# Altium schematic sheet DRIVERS.SchDoc
size A; Organization: Altium Limited; Address1: L3, 12a Rodborough Rd; Address2: Frenchs Forest; Address3: NSW; Address4: Australia 2086; DocumentNumber: 3; SheetNumber: 3; SheetTotal: 4
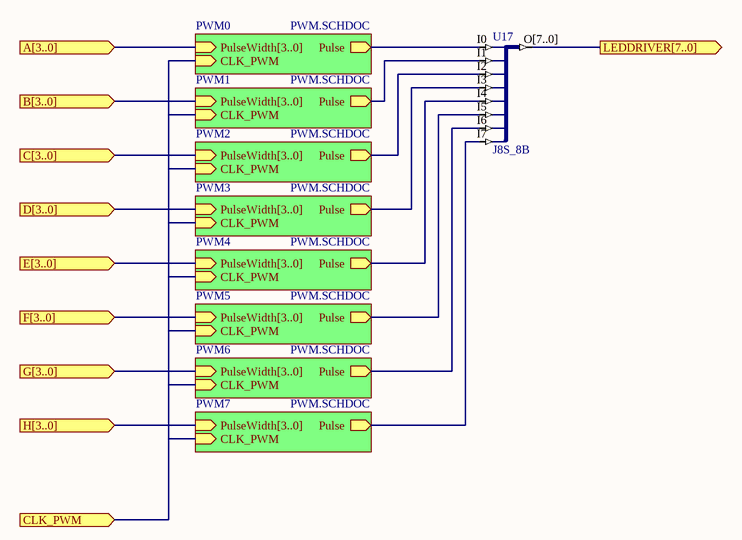
[diagram p0: DRIVERS.SchDoc]

## Parts
U17  J8S_8B

## Sub-sheets
PWM0 = PWM.SCHDOC: Pulse (out), CLK_PWM (in), PulseWidth[3..0] (in)
PWM1 = PWM.SCHDOC: Pulse (out), CLK_PWM (in), PulseWidth[3..0] (in)
PWM2 = PWM.SCHDOC: Pulse (out), CLK_PWM (in), PulseWidth[3..0] (in)
PWM3 = PWM.SCHDOC: Pulse (out), CLK_PWM (in), PulseWidth[3..0] (in)
PWM4 = PWM.SCHDOC: Pulse (out), CLK_PWM (in), PulseWidth[3..0] (in)
PWM5 = PWM.SCHDOC: Pulse (out), CLK_PWM (in), PulseWidth[3..0] (in)
PWM6 = PWM.SCHDOC: Pulse (out), CLK_PWM (in), PulseWidth[3..0] (in)
PWM7 = PWM.SCHDOC: Pulse (out), CLK_PWM (in), PulseWidth[3..0] (in)

## Ports
A[3..0] (in), B[3..0] (in), C[3..0] (in), CLK_PWM (in), D[3..0] (in), E[3..0] (in), F[3..0] (in), G[3..0] (in), H[3..0] (in), LEDDRIVER[7..0] (out)

## Nets
CLK_PWM: port CLK_PWM, sheet PWM7/CLK_PWM, sheet PWM6/CLK_PWM, sheet PWM5/CLK_PWM, sheet PWM4/CLK_PWM, sheet PWM3/CLK_PWM, sheet PWM2/CLK_PWM, sheet PWM1/CLK_PWM, sheet PWM0/CLK_PWM
LEDDRIVER[7..0]: U17.O[7..0] ; port LEDDRIVER[7..0]
NetU17_I0: U17.I0 ; sheet PWM0/Pulse
NetU17_I1: U17.I1 ; sheet PWM1/Pulse
NetU17_I2: U17.I2 ; sheet PWM2/Pulse
NetU17_I3: U17.I3 ; sheet PWM3/Pulse
NetU17_I4: U17.I4 ; sheet PWM4/Pulse
NetU17_I5: U17.I5 ; sheet PWM5/Pulse
NetU17_I6: U17.I6 ; sheet PWM6/Pulse
NetU17_I7: U17.I7 ; sheet PWM7/Pulse

## Buses and harness runs
bus port A[3..0] = sheet PWM0/PulseWidth[3..0]
bus port B[3..0] = sheet PWM1/PulseWidth[3..0]
bus port C[3..0] = sheet PWM2/PulseWidth[3..0]
bus port D[3..0] = sheet PWM3/PulseWidth[3..0]
bus port E[3..0] = sheet PWM4/PulseWidth[3..0]
bus port F[3..0] = sheet PWM5/PulseWidth[3..0]
bus port G[3..0] = sheet PWM6/PulseWidth[3..0]
bus port H[3..0] = sheet PWM7/PulseWidth[3..0]

## Notes on the sheet
- Title
- Size:
- Date:
- A
- Number:
- Time:
- Revision:
- Sheet
- of
- File:

## Library data of the parts
U17 = J8S_8B: 8 Single pin inputs to single 8-Bit output bus; ArchiveName: GENERIC; VHDLIB_SIM: GENERIC_LIB; Published: 29-Jan-2004; Publisher: Altium Limited; Core Revision: 1.00.00